# Altium schematic sheet LTC2949_Connectors.SchDoc: LTC2949 Connectors
size A4; Author: Leo Xie & Naveela Sookoo; Organization: Waterloop; Address1: 200 University Avenue W; Address2: Engineering 5, 1104; Address3: Waterloo, Ontario; Address4: N2L 3G1; DocumentNumber: 3; Revision: 1; SheetNumber: 3; SheetTotal: 3
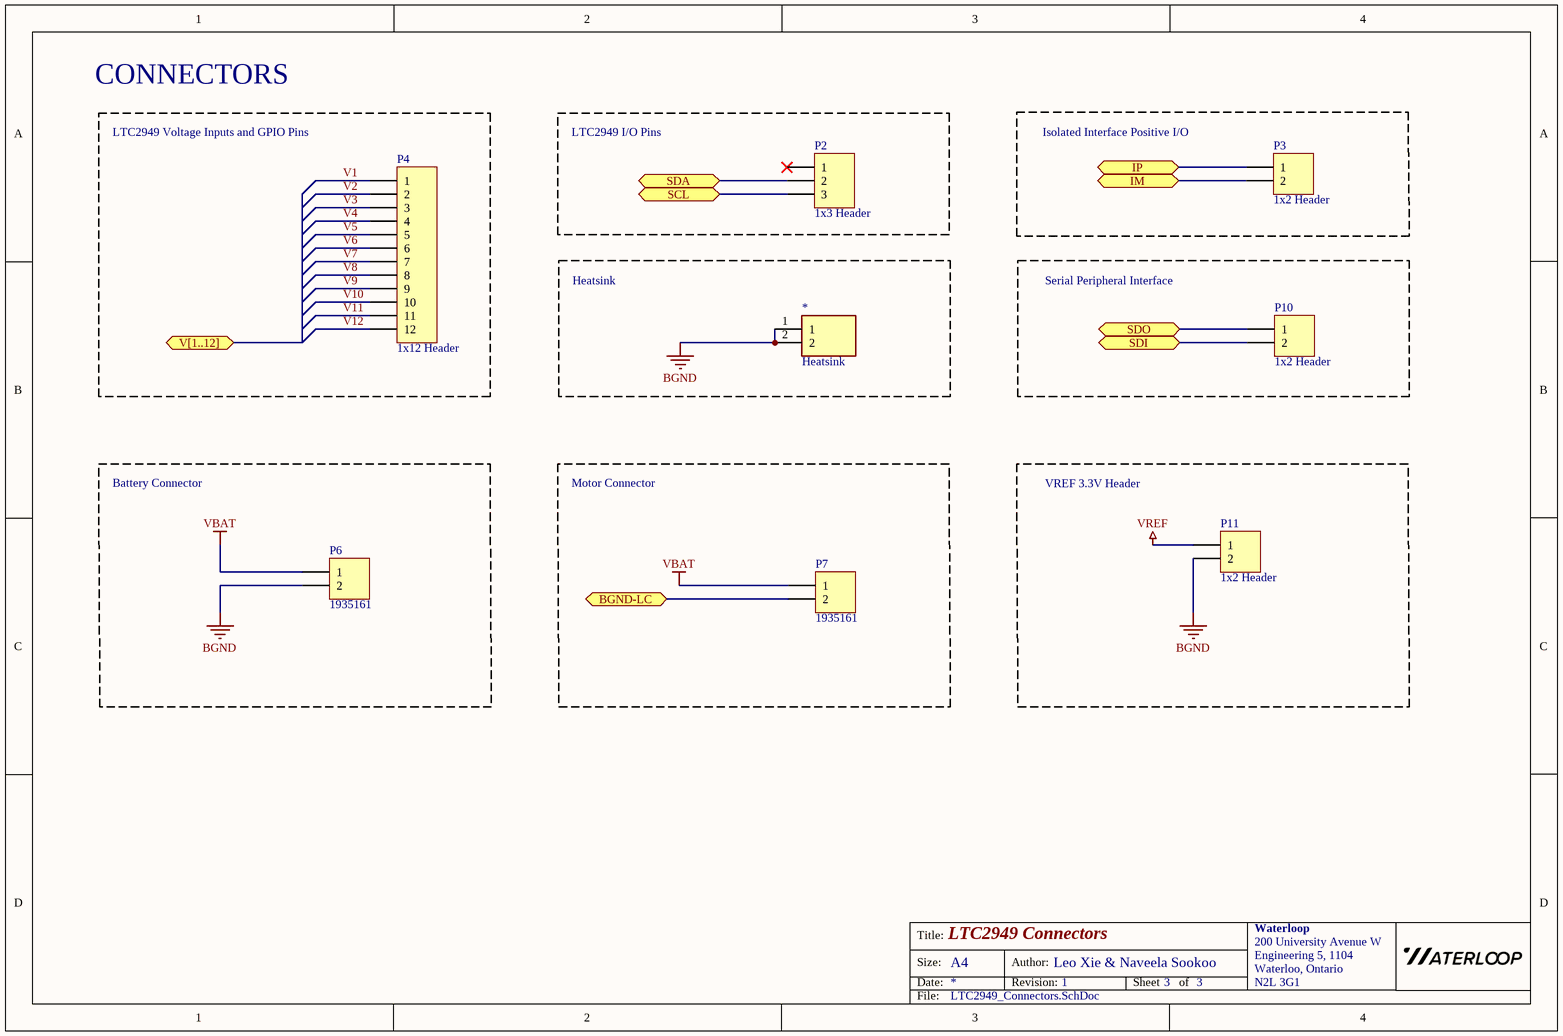
[diagram p0: LTC2949_Connectors.SchDoc]

## Parts
*  Heatsink  [10C/W Vertical Heatsink with Pins for TO-220]
P2  1x3 Header  [HDR1X3]
P3  1x2 Header  [HDR1X2]
P4  1x12 Header  [HDR1X12]
P6  1935161  [1935161]
P7  1935161  [1935161]
P10  1x2 Header  [HDR1X2]
P11  1x2 Header  [HDR1X2]

## Blocks framed on the sheet
LTC2949 Voltage Inputs and GPIO Pins: P4
LTC2949 I/O Pins: P2
Isolated Interface Positive I/O: P3
Heatsink: *
Serial Peripheral Interface: P10
Battery Connector: P6
Motor Connector: P7

## Ports
BGND-LC (bidir), IM (bidir), IP (bidir), SCL (bidir), SDA (bidir), SDI (bidir), SDO (bidir), V[1..12] (bidir)

## Nets
BGND: *.1 *.2 P6.2 P11.2
VBAT: P6.1 P7.1
VREF: P11.1
BGND-LC: P7.2 ; port BGND-LC
IM: P3.2 ; port IM
IP: P3.1 ; port IP
SCL: P2.3 ; port SCL
SDA: P2.2 ; port SDA
SDI: P10.2 ; port SDI
SDO: P10.1 ; port SDO
V1: P4.1
V2: P4.2
V3: P4.3
V4: P4.4
V5: P4.5
V6: P4.6
V7: P4.7
V8: P4.8
V9: P4.9
V10: P4.10
V11: P4.11
V12: P4.12

Not connected (* = marked no-connect by the designer): P2 1*

## Notes on the sheet
- CONNECTORS
- VREF 3.3V Header
- Title:
- Size:
- Date:
- A4
- Author:
- Revision:
- Sheet
- of
- File:

## Library data of the parts
* = Heatsink: Vertical Heatsink for TO-220 Package
P2 = 1x3 Header: 1x3 Pin Header
P3 P10 P11 = 1x2 Header: 1x2 Pin Header
P4 = 1x12 Header: 1x12 Pin Header
P6 P7 = 1935161: 1x2 Screw Terminal Block; Manufacturer: CUI Devices; Manufacturer Part Number: TB002-500-02BE; Supplier: Digikey; Supplier Part Number: 102-6145-ND